# Altium schematic sheet FTDI.schdoc: Title
size 420 x 297 mm; Author: G.Kasprowicz; CompanyName: WUT ISE; DrawnBy: G.Kasprowicz; Organization: WUT ISE; Address1: PW ISE; Address2: Nowowiejska 15/19 00-665 Warsaw; Address3: gkasprow@gmail.com; Revision: 2; SheetNumber: -; SheetTotal: -; ModifiedBy: -; CheckedDate: -; Title2: Title 2; DivGrp: WUT ISE; Designer: G.Kasprowicz; ModifiedDate: -; ProjectName: Sensor Box
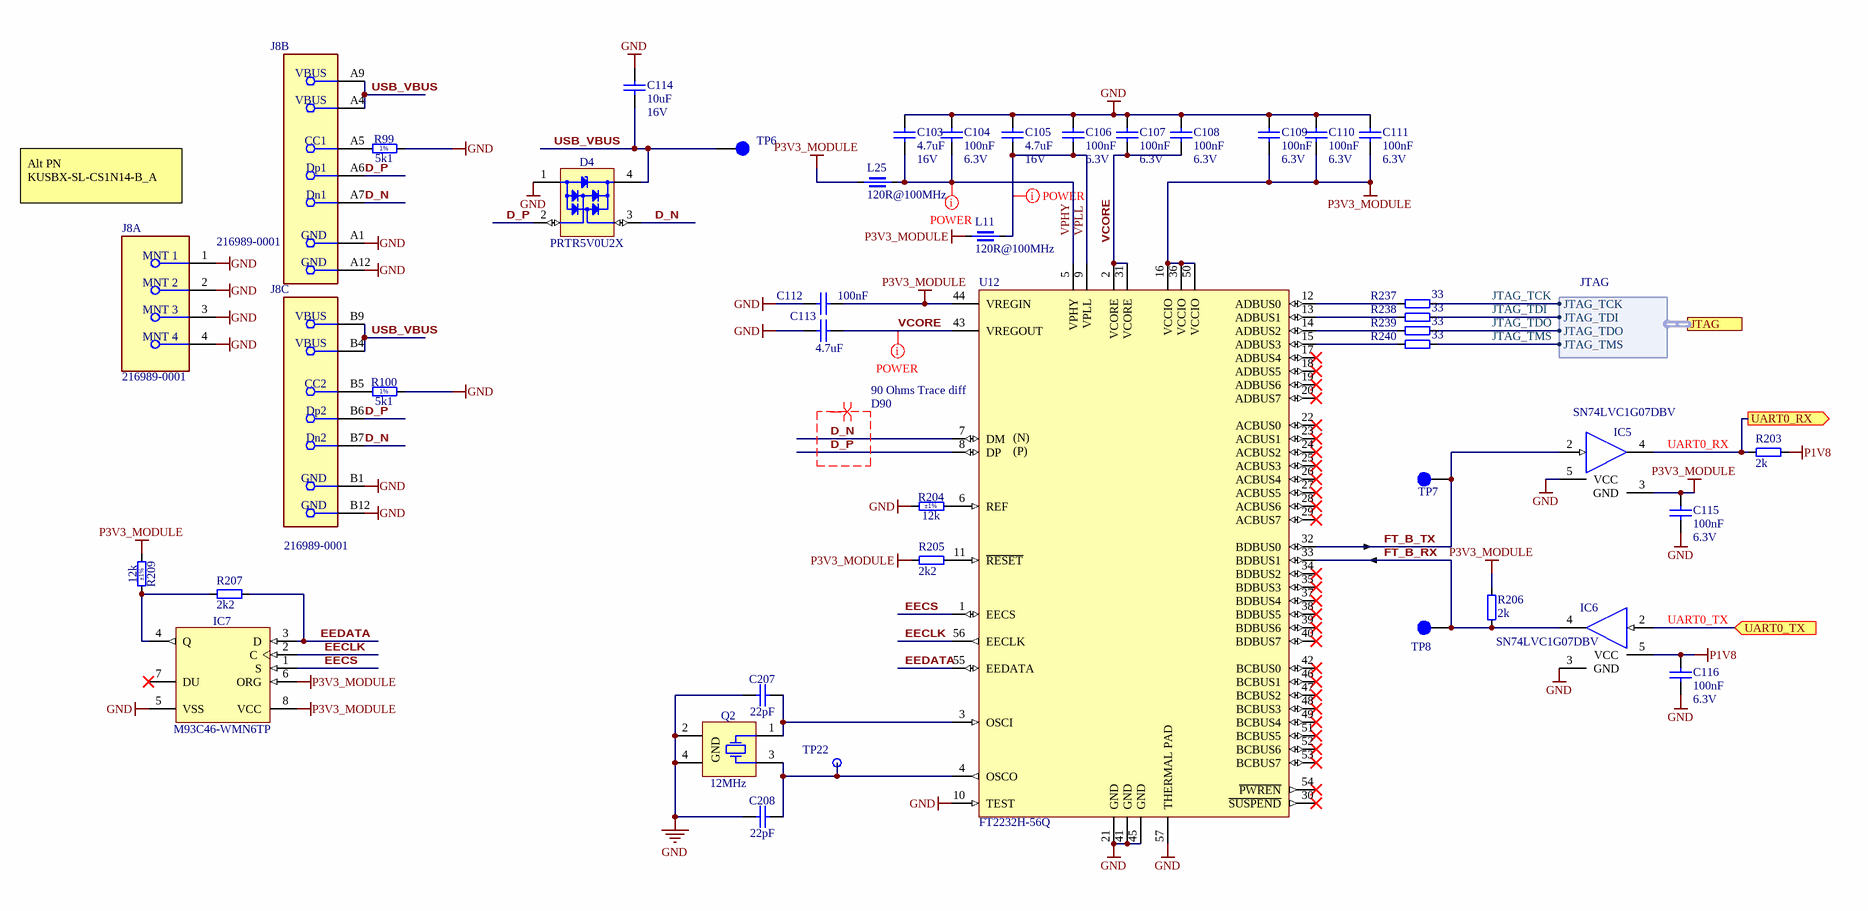
[diagram p0: FTDI.schdoc]

## Parts
C103  4.7uF  Voltage: 16V  [CAPC1709X95N]
C104  100nF  Voltage: 6.3V  [CAPC0603X33N]
C105  4.7uF  Voltage: 16V  [CAPC1709X95N]
C106  100nF  Voltage: 6.3V  [CAPC0603X33N]
C107  100nF  Voltage: 6.3V  [CAPC0603X33N]
C108  100nF  Voltage: 6.3V  [CAPC0603X33N]
C109  100nF  Voltage: 6.3V  [CAPC0603X33N]
C110  100nF  Voltage: 6.3V  [CAPC0603X33N]
C111  100nF  Voltage: 6.3V  [CAPC0603X33N]
C112  100nF  [CAPC0603X33N]
C113  4.7uF  [CAPC1709X95N]
C114  10uF  Voltage: 16V  [CAPC1608X80N]
C115  100nF  Voltage: 6.3V  [CAPC0603X33N]
C116  100nF  Voltage: 6.3V  [CAPC0603X33N]
C207  22pF  [CAPC1005X55N]
C208  22pF  [CAPC1005X55N]
D4  PRTR5V0U2X  [SOT190P230X110-4N]
IC5  SN74LVC1G07DBV  [SOT95P280X145-5N]
IC6  SN74LVC1G07DBV  [SOT95P280X145-5N]
IC7  M93C46-WMN6TP  [SOIC127P600X175-8N]
J8  216989-0001  [FP-216989-0001-MFG]  (parts A,B,C of 3)
L11  120R@100MHz  [INDC1608X65N]
L25  120R@100MHz  [INDC1608X65N]
Q2  12MHz  [XTAL_TXC_7M]
R99  5k1  [RESC1005X40N]
R100  5k1  [RESC1005X40N]
R203  2k  [RESC1005X40N]
R204  12k  Tolerance: ±1%  [RESC1005X40N]
R205  2k2  [RESC1005X40N]
R206  2k  [RESC1005X40N]
R207  2k2  [RESC1005X40N]
R209  12k  Tolerance: ±1%  [RESC1005X40N]
R237  33  [RESC1005X40N]
R238  33  [RESC1005X40N]
R239  33  [RESC1005X40N]
R240  33  [RESC1005X40N]
TP6  Testpoint 0.8mm  [TP_0.8mm]  (value not drawn)
TP7  Testpoint 0.8mm  [TP_0.8mm]  (value not drawn)
TP8  Testpoint 0.8mm  [TP_0.8mm]  (value not drawn)
TP22  Q2  [TPS127]  (value not drawn)
U12  FT2232H-56Q  [QFN50P800X800-57T610X610N]

## Ports
JTAG (harness JTAG), UART0_RX (out), UART0_TX (in)

## Harnesses
JTAG: JTAG_TCK, JTAG_TDI, JTAG_TDO, JTAG_TMS

## Nets
GND: C103.2 C104.2 C105.2 C106.2 C107.2 C108.2 C109.1 C109.2 C110.1 C110.2 C111.1 C111.2 C112.1 C112.2 C113.1 C114.1 C115.1 C115.2 C116.1 C116.2 C207.1 C208.1 D4.1(GND) IC5.3(GND) IC5.5(VCC) IC6.3(GND) IC6.5(VCC) IC7.5(VSS) IC7.6(ORG) IC7.8(VCC) J8.1(MNT_1) J8.2(MNT_2) J8.3(MNT_3) J8.4(MNT_4) J8.A1(GND) J8.A12(GND) J8.B1(GND) J8.B12(GND) L11.1 L25.1 Q2.2(GND) Q2.4(GND) R99.2 R100.2 R203.2 R204.1 R205.1 R206.1 R209.1 U12.10(TEST) U12.16(VCCIO) U12.21(GND) U12.36(VCCIO) U12.41(GND) U12.44(VREGIN) U12.45(GND) U12.50(VCCIO) U12.57(THERMAL_PAD)  [also labelled P1V8, P3V3_MODULE, VDD]
D_N: D4.3(I/O2) J8.A7(Dn1) J8.B7(Dn2) U12.7(DM)
D_P: D4.2(I/O1) J8.A6(Dp1) J8.B6(Dp2) U12.8(DP)
EECLK: IC7.2(C) U12.56(EECLK)
EECS: IC7.1(S) U12.1(EECS)
EEDATA: IC7.3(D) R207.1 U12.55(EEDATA)
FT_B_RX: IC6.4(OUT) R206.2 TP8.1 U12.33(BDBUS1)
FT_B_TX: IC5.2(IN) TP7.1 U12.32(BDBUS0)
JTAG_TCK: R237.2 ; port JTAG.JTAG_TCK
JTAG_TDI: R238.2 ; port JTAG.JTAG_TDI
JTAG_TDO: R239.2 ; port JTAG.JTAG_TDO
JTAG_TMS: R240.2 ; port JTAG.JTAG_TMS
UART0_RX: IC5.4(OUT) R203.1 ; port UART0_RX
UART0_TX: IC6.2(IN) ; port UART0_TX
USB_VBUS: C114.2 D4.4(VCC) J8.A4(VBUS) J8.A9(VBUS) J8.B4(VBUS) J8.B9(VBUS) TP6.1
VCORE: C107.1 C108.1 C113.2 U12.2(VCORE) U12.31(VCORE) U12.43(VREGOUT)
VPHY: C103.1 C104.1 L25.2 U12.5(VPHY)
VPLL: C105.1 C106.1 L11.2 U12.9(VPLL)
NetC207_2: C207.2 Q2.1(X) U12.3(OSCI)
NetC208_2: C208.2 Q2.3(X) TP22.1 U12.4(OSCO)
NetIC7_4: IC7.4(Q) R207.2 R209.2
NetJ8_A5: J8.A5(CC1) R99.1
NetJ8_B5: J8.B5(CC2) R100.1
NetR204_2: R204.2 U12.6(REF)
NetR205_2: R205.2 U12.11(~{RESET})
NetR237_1: R237.1 U12.12(ADBUS0)
NetR238_1: R238.1 U12.13(ADBUS1)
NetR239_1: R239.1 U12.14(ADBUS2)
NetR240_1: R240.1 U12.15(ADBUS3)

Not connected (* = marked no-connect by the designer): IC7 7(DU)*; U12 17(ADBUS4)* 18(ADBUS5)* 19(ADBUS6)* 20(ADBUS7)* 22(ACBUS0)* 23(ACBUS1)* 24(ACBUS2)* 25(ACBUS3)* 26(ACBUS4)* 27(ACBUS5)* 28(ACBUS6)* 29(ACBUS7)* 30(~{SUSPEND})* 34(BDBUS2)* 35(BDBUS3)* 37(BDBUS4)* 38(BDBUS5)* 39(BDBUS6)* 40(BDBUS7)* 42(BCBUS0)* 46(BCBUS1)* 47(BCBUS2)* 48(BCBUS3)* 49(BCBUS4)* 51(BCBUS5)* 52(BCBUS6)* 53(BCBUS7)* 54(~{PWREN})*

## Layout directives
net class POWER: VCORE, VPHY, VPLL
differential pair; differential pair class 90 Ohms Trace diff; net class D90: D_N, D_P

## Notes on the sheet
- Alt PN KUSBX-SL-CS1N14-B_A
- Project/Equipment
- Document
- Designer
- Drawn by
- Check.by
- Copyright WUT ISE 2020.
  This documentation describes Open Hardware and is licensed under the CERN OHL v.1.2. You may redistribute and modify this documentation under the terms of the CERN OHL v.1.2. (http://ohwr.org/CERNOHL). This documentation is distributed WITHOUT ANY EXPRESS OR IMPLIED WARRANTY, INCLUDING OF MERCHANTABILITY, SATISFACTORY QUALITY AND FITNESS FOR A PARTICULAR PURPOSE. Please see the CERN OHL v.1.2 for applicable conditions.
- Contact
- File
- Last Mod.
- Print Date
- Sheet
- Size
- A3
- of
- Rev
- (in symbol 27277) (N); (P)
- (in symbol R0402_5K1_1%_0.0625W_100PPM) 1%

## Library data of the parts
C103 C105 = CC0603_4.7UF_16V_10%_X5R: Non-polarised capacitor; Part Description: SMD Multilayer Chip Ceramic Capacitor; Manufacturer: GENERIC; Manufacturer1 Part Number: EMK107ABJ475KA-T; Tolerance: ±10%; TC: X5R; Case: 0603; Value: 4.7uF; Part Number: CC0603_4.7UF_16V_10%_X5R; Component Kind: Standard; Component Type: Standard; Pin Count: 2; Status: None; Manufacturer Part Number: CC0603_4.7UF_16V_10%_X5R; Mounted: Yes; Socket: No; SMD: Yes; Sense: No; Manufacturer1 Example: TAIYO YUDEN; Manufacturer1 ComponentHeight: 0.95mm; HelpURL: \\cern.ch\dfs\Applications\Altium\Datasheets\CC0603_X7R_TAIYO-YUDEN_HIGH-VALUE.pdf; Author: CERN DEM JLC; CreateDate: 16.12.2013; LatestRevisionDate: 16.09.2014
C104 C106-C111 C115 C116 = CC0201_100NF_6.3V_10%_X7R: Non-polarised capacitor; Part Description: SMD Multilayer Chip Ceramic Capacitor; Manufacturer: GENERIC; Manufacturer1 Part Number: CC0201KRX7R5BB104; Tolerance: ±10%; TC: X7R; Case: 0201; Value: 100nF; Part Number: CC0201_100NF_6.3V_10%_X7R; Component Kind: Standard; Component Type: Standard; Pin Count: 2; Status: Not Recommended; Manufacturer Part Number: CC0201_100NF_6.3V_10%_X7R; Mounted: Yes; Socket: No; SMD: Yes; Sense: No; Manufacturer1 Example: YAGEO PHYCOMP; Manufacturer1 ComponentHeight: 0.33mm; HelpURL: \\cern.ch\dfs\Applications\Altium\Datasheets\CC0201_X7R_YAGEO_6.3VTO50V.pdf; Author: CERN DEM BC; CreateDate: 20.11.2020; LatestRevisionDate: 20.11.2020
C112 = CC0201_100NF_6.3V_10%_X7R: Non-polarised capacitor; Part Description: SMD Multilayer Chip Ceramic Capacitor; Manufacturer: GENERIC; Manufacturer1 Part Number: CC0201KRX7R5BB104; Voltage: 6.3V; Tolerance: ±10%; TC: X7R; Case: 0201; Value: 100nF; Part Number: CC0201_100NF_6.3V_10%_X7R; Component Kind: Standard; Component Type: Standard; Pin Count: 2; Status: Not Recommended; Manufacturer Part Number: CC0201_100NF_6.3V_10%_X7R; Mounted: Yes; Socket: No; SMD: Yes; Sense: No; Manufacturer1 Example: YAGEO PHYCOMP; Manufacturer1 ComponentHeight: 0.33mm; HelpURL: \\cern.ch\dfs\Applications\Altium\Datasheets\CC0201_X7R_YAGEO_6.3VTO50V.pdf; Author: CERN DEM BC; CreateDate: 20.11.2020; LatestRevisionDate: 20.11.2020
C113 = CC0603_4.7UF_16V_10%_X5R: Non-polarised capacitor; Part Description: SMD Multilayer Chip Ceramic Capacitor; Manufacturer: GENERIC; Manufacturer1 Part Number: EMK107ABJ475KA-T; Voltage: 16V; Tolerance: ±10%; TC: X5R; Case: 0603; Value: 4.7uF; Part Number: CC0603_4.7UF_16V_10%_X5R; Component Kind: Standard; Component Type: Standard; Pin Count: 2; Status: None; Manufacturer Part Number: CC0603_4.7UF_16V_10%_X5R; Mounted: Yes; Socket: No; SMD: Yes; Sense: No; Manufacturer1 Example: TAIYO YUDEN; Manufacturer1 ComponentHeight: 0.95mm; HelpURL: \\cern.ch\dfs\Applications\Altium\Datasheets\CC0603_X7R_TAIYO-YUDEN_HIGH-VALUE.pdf; Author: CERN DEM JLC; CreateDate: 16.12.2013; LatestRevisionDate: 16.09.2014
C114 = CC0603_10UF_16V_20%_X5R: Non-polarised capacitor; Part Description: SMD Multilayer Chip Ceramic Capacitor; Manufacturer: GENERIC; Manufacturer1 Part Number: GRM188R61C106MA73D; Tolerance: ±20%; TC: X5R; Case: 0603; Value: 10uF; Part Number: CC0603_10UF_16V_20%_X5R; Component Kind: Standard; Component Type: Standard; Pin Count: 2; Status: None; Manufacturer Part Number: CC0603_10UF_16V_20%_X5R; Mounted: Yes; Socket: No; SMD: Yes; Sense: No; Manufacturer1 Example: MURATA; Manufacturer1 ComponentHeight: 0.8mm; HelpURL: \\cern.ch\dfs\Applications\Altium\Datasheets\CC0603_X5R_MURATA_GRM.pdf; Author: CERN DEM MR; CreateDate: 02.03.2016; LatestRevisionDate: 02.03.2016
C207 C208 = CC0402_22PF_50V_5%_C0G: Non-polarised capacitor; Part Description: SMD Multilayer Chip Ceramic Capacitor; Manufacturer: GENERIC; Manufacturer1 Part Number: C0402C220J5GACTU; Voltage: 50V; TC: C0G/NP0; Tolerance: ±5%; Part Number: CC0402_22PF_50V_5%_C0G; Component Kind: Standard; Component Type: Standard; Pin Count: 2; Value: 22pF; Status: Preferred; Manufacturer Part Number: CC0402_22PF_50V_5%_C0G; Case: 0402; Mounted: Yes; Socket: No; SMD: Yes; Sense: No; Manufacturer1 Example: KEMET; Manufacturer1 ComponentHeight: 0.55mm; HelpURL: \\cern.ch\dfs\Applications\Altium\Datasheets\CC0805_C0G_KEMET_(Commercial Grade).pdf; Author: CERN DEM JLC; CreateDate: 03.12.2007; LatestRevisionDate: 03.12.2007
D4 = PRTR5V0U2X: Ultra Low Capacitance Double Rail-to-Rail ESD Protection Diode; Part Description: Ultra Low Capacitance (1pF) Double Rail-to-Rail ESD Protection Diode (8kV); Manufacturer: NXP SEMICONDUCTORS; Voltage: 5.5V; PressFit: No; Bonding: No; Part Number: PRTR5V0U2X; Component Kind: Standard; Component Type: Standard; Device: PRTR5V0U2X; PackageDescription: SOT143B, SOT, 1.90mm Pitch; 4 Pin, 1.30mm W X 2.90mm L X 1.10mm H body, IPC Medium Density; Manufacturer Part Number: PRTR5V0U2X; Pin Count: 4; Case: SOT143B; Mounted: Yes; Socket: No; SMD: Yes; Sense: No; ComponentHeight: 1.1mm; HelpURL: \\cern.ch\dfs\Applications\Altium\Datasheets\PRTR5V0U2X.pdf; Author: CERN DEM JLC; CreateDate: 22.03.2011; LatestRevisionDate: 22.03.2011
IC5 IC6 = SN74LVC1G07DBV: Single Buffer/Driver With Open-Drain Output; Manufacturer: TEXAS INSTRUMENTS; PressFit: No; Bonding: No; Part Number: SN74LVC1G07DBV; Component Kind: Standard; Component Type: Standard; Device: SN74LVC1G07DBV; PackageDescription: SOT, 0.95mm Pitch; 5 Pin, 1.60mm W X 2.90mm L X 1.45mm H body, IPC Medium Density; Part Description: Single Buffer/Driver with Open-Drain Output; Manufacturer Part Number: SN74LVC1G07DBV; Pin Count: 5; Case: SOT23-5; Mounted: Yes; Socket: No; SMD: Yes; Sense: No; ComponentHeight: 1.45mm; Author: CERN DEM BC; HelpURL: \\cern.ch\dfs\Applications\Altium\Datasheets\SN74LVC1G07DBV.pdf; CreateDate: 19.02.2020; LatestRevisionDate: 19.02.2020
IC7 = M93C46-WMN6TP: 2.5 to 5.5 V, 1Kb (128x8) Serial Microwire Bus EEPROM; Part Description: 1Kbit (128 x 8 bit or 64 x 16 bit) MICROWIRE® Serial Access EEPROM; Manufacturer: ST MICROELECTRONICS; PressFit: No; Bonding: No; Part Number: M93C46-WMN6TP; Component Kind: Standard; Component Type: Standard; Device: M93C46-WMN6TP; PackageDescription: SOIC 8, Pitch 1.27mm - Body 4x5mm, IPC Medium Density; Manufacturer Part Number: M93C46-WMN6TP; Pin Count: 8; Case: SOIC8; Mounted: Yes; Socket: No; SMD: Yes; Sense: No; ComponentHeight: 1.75mm; HelpURL: \\cern.ch\dfs\Applications\Altium\Datasheets\M93C46-WMN6TP.pdf; Author: CERN DEM JLC; CreateDate: 15.11.2012; LatestRevisionDate: 15.11.2012
J8 = CMP-04767-000020-1: CONN RCPT USB2.0 TYPE C 24POS RA
L11 L25 = IND0603_MURATA_BLM18SG121TN1D: Part Description: SMD EMIFIL Suppression Chip Ferrite Bead; Manufacturer: MURATA; Power: 3A; Resistance: 0.025R; Tolerance: ±25%; Case: 0603; HelpURL: \\cern.ch\dfs\Applications\Altium\Datasheets\IND0603_MURATA_BLM18S.pdf; Part Number: IND0603_MURATA_BLM18SG121TN1D; Component Kind: Standard; Component Type: Standard; Pin Count: 2; Value: 120R@100MHz; Manufacturer Part Number: BLM18SG121TN1D; Mounted: Yes; Socket: No; SMD: Yes; Sense: No; ComponentHeight: 0.65mm; Author: CERN DEM JLC; CreateDate: 23.07.2014; LatestRevisionDate: 25.10.2018
Q2 = XTAL_12MHZ_TXC_7M-12.000MAAJ-T: Crystal 4 pins 1=XTAL Control 2=GND3=XTAL 4=GND; Part Description: ±30ppm 18pF -20°C to +70°C  4 Pins, 3.2x2.5X0.8mm, SMD Sealing Crystal, 7M Series; Manufacturer: TXC CORPORATION; PressFit: No; Bonding: No; Part Number: XTAL_12MHZ_TXC_7M-12.000MAAJ-T; Component Kind: Standard; Component Type: Standard; PackageDescription: 4 Pins, 2.5x3.2mm, SMD Sealing Crystal, 7M Serie; Value: 12MHz; Manufacturer Part Number: 7M-12.000MAAJ-T; Pin Count: 4; Mounted: Yes; Socket: No; SMD: Yes; Sense: No; ComponentHeight: 0.8mm; HelpURL: \\cern.ch\dfs\Applications\Altium\Datasheets\XTAL_TXC_7M.pdf; Author: CERN DEM JLC; CreateDate: 19.06.2012; LatestRevisionDate: 19.06.2012
R99 R100 = R0402_5K1_1%_0.0625W_100PPM: Resistor - 1%; Part Description: General Purpose Thick Film Chip Resistor; Manufacturer: GENERIC; Manufacturer1 Part Number: 232270675102L; TC: ±100ppm/°C; PressFit: No; Part Number: R0402_5K1_1%_0.0625W_100PPM; Component Kind: Standard; Component Type: Standard; Pin Count: 2; Value: 5k1; Status: Not Recommended; Power: 0.0625W; Tolerance: ±1%; Manufacturer Part Number: R0402_5K1_1%_0.0625W_100PPM; Case: 0402; Mounted: Yes; Sense: No; Socket: No; SMD: Yes; Manufacturer1 Example: YAGEO PHYCOMP; Manufacturer1 ComponentHeight: 0.4mm; HelpURL: \\cern.ch\dfs\Applications\Altium\Datasheets\R0402_Phycomp_RC0402.pdf; Author: CERN DEM JLC; CreateDate: 03.12.2007; LatestRevisionDate: 17.10.2012
R203 R206 = R0402_2K_1%_0.0625W_100PPM: Resistor - 1%; Part Description: General Purpose Thick Film Chip Resistor; Manufacturer: GENERIC; Manufacturer1 Part Number: 232270672002L; TC: ±100ppm/°C; PressFit: No; Case: 0402; Value: 2k; Tolerance: ±1%; Part Number: R0402_2K_1%_0.0625W_100PPM; Component Kind: Standard; Component Type: Standard; Pin Count: 2; Status: Not Recommended; Power: 0.0625W; Manufacturer Part Number: R0402_2K_1%_0.0625W_100PPM; Mounted: Yes; Sense: No; Socket: No; SMD: Yes; Manufacturer1 Example: YAGEO PHYCOMP; Manufacturer1 ComponentHeight: 0.4mm; HelpURL: \\cern.ch\dfs\Applications\Altium\Datasheets\R0402_Phycomp_RC0402.pdf; Author: CERN DEM JLC; CreateDate: 03.12.2007; LatestRevisionDate: 17.10.2012
R204 R209 = R0402_12K_1%_0.0625W_100PPM: Resistor - 1%; Part Description: General Purpose Thick Film Chip Resistor; Manufacturer: GENERIC; Manufacturer1 Part Number: 232270671203L; TC: ±100ppm/°C; PressFit: No; Part Number: R0402_12K_1%_0.0625W_100PPM; Component Kind: Standard; Component Type: Standard; Pin Count: 2; Value: 12k; Status: Not Recommended; Power: 0.0625W; Manufacturer Part Number: R0402_12K_1%_0.0625W_100PPM; Case: 0402; Mounted: Yes; Sense: No; Socket: No; SMD: Yes; Manufacturer1 Example: YAGEO PHYCOMP; Manufacturer1 ComponentHeight: 0.4mm; HelpURL: \\cern.ch\dfs\Applications\Altium\Datasheets\R0402_Phycomp_RC0402.pdf; Author: CERN DEM JLC; CreateDate: 03.12.2007; LatestRevisionDate: 17.10.2012
R205 R207 = R0402_2K2_1%_0.0625W_100PPM: Resistor - 1%; Part Description: General Purpose Thick Film Chip Resistor; Manufacturer: GENERIC; Manufacturer1 Part Number: 232270672202L; TC: ±100ppm/°C; PressFit: No; Case: 0402; Value: 2k2; Tolerance: ±1%; Part Number: R0402_2K2_1%_0.0625W_100PPM; Component Kind: Standard; Component Type: Standard; Pin Count: 2; Status: Not Recommended; Power: 0.0625W; Manufacturer Part Number: R0402_2K2_1%_0.0625W_100PPM; Mounted: Yes; Sense: No; Socket: No; SMD: Yes; Manufacturer1 Example: YAGEO PHYCOMP; Manufacturer1 ComponentHeight: 0.4mm; HelpURL: \\cern.ch\dfs\Applications\Altium\Datasheets\R0402_Phycomp_RC0402.pdf; Author: CERN DEM JLC; CreateDate: 03.12.2007; LatestRevisionDate: 17.10.2012
R237-R240 = R0402_33R_1%_0.0625W_100PPM: Resistor - 1%; Part Description: General Purpose Thick Film Chip Resistor; Manufacturer: GENERIC; Manufacturer1 Part Number: 232270673309L; TC: ±100ppm/°C; PressFit: No; Case: 0402; Value: 33; Tolerance: ±1%; Part Number: R0402_33R_1%_0.0625W_100PPM; Component Kind: Standard; Component Type: Standard; Pin Count: 2; Status: Not Recommended; Power: 0.0625W; Manufacturer Part Number: R0402_33R_1%_0.0625W_100PPM; Mounted: Yes; Sense: No; Socket: No; SMD: Yes; Manufacturer1 Example: YAGEO PHYCOMP; Manufacturer1 ComponentHeight: 0.4mm; HelpURL: \\cern.ch\dfs\Applications\Altium\Datasheets\R0402_Phycomp_RC0402.pdf; Author: CERN DEM JLC; CreateDate: 03.12.2007; LatestRevisionDate: 17.10.2012
TP6-TP8 = 26289: AN: 26289; Mixed: MECH
TP22 = SMD_PAD_1.27X1.27MM: Test Point; Part Description: 1.27mm x 1.27mm PCB Copper Area (SMD Test Point); Mounted: No; Part Number: SMD_PAD_1.27X1.27MM; Component Kind: Standard (No BOM); Component Type: Standard (No BOM); Pin Count: 1; Family: Test Point; Socket: No; SMD: Yes; Sense: No; Status: None; ComponentHeight: 0mm; HelpURL: Undefined; Author: CERN DEM JLC; CreateDate: 12.01.2008; LatestRevisionDate: 12.01.2008; PackageDescription: 1.27mm x 1.27mm PCB Copper Area (SMD Test Point)
U12 = 27277: AN: 27277; Trenz-Stock: Yes; Mixed: SMT; Temperature-Range: -40/+85; Extra: Dual High Speed USB to Multipurpose UART/FIFO IC; Case: VQFN56; HelpURL: B:\AD\adlib\datasheet\FT2232H; Preferred: Yes; H-ART: FT2232H-56Q; Storage-Temperature: -65/+150(Abs)